# EAGLE design Drive_7seg (EAGLE 7.2.0)
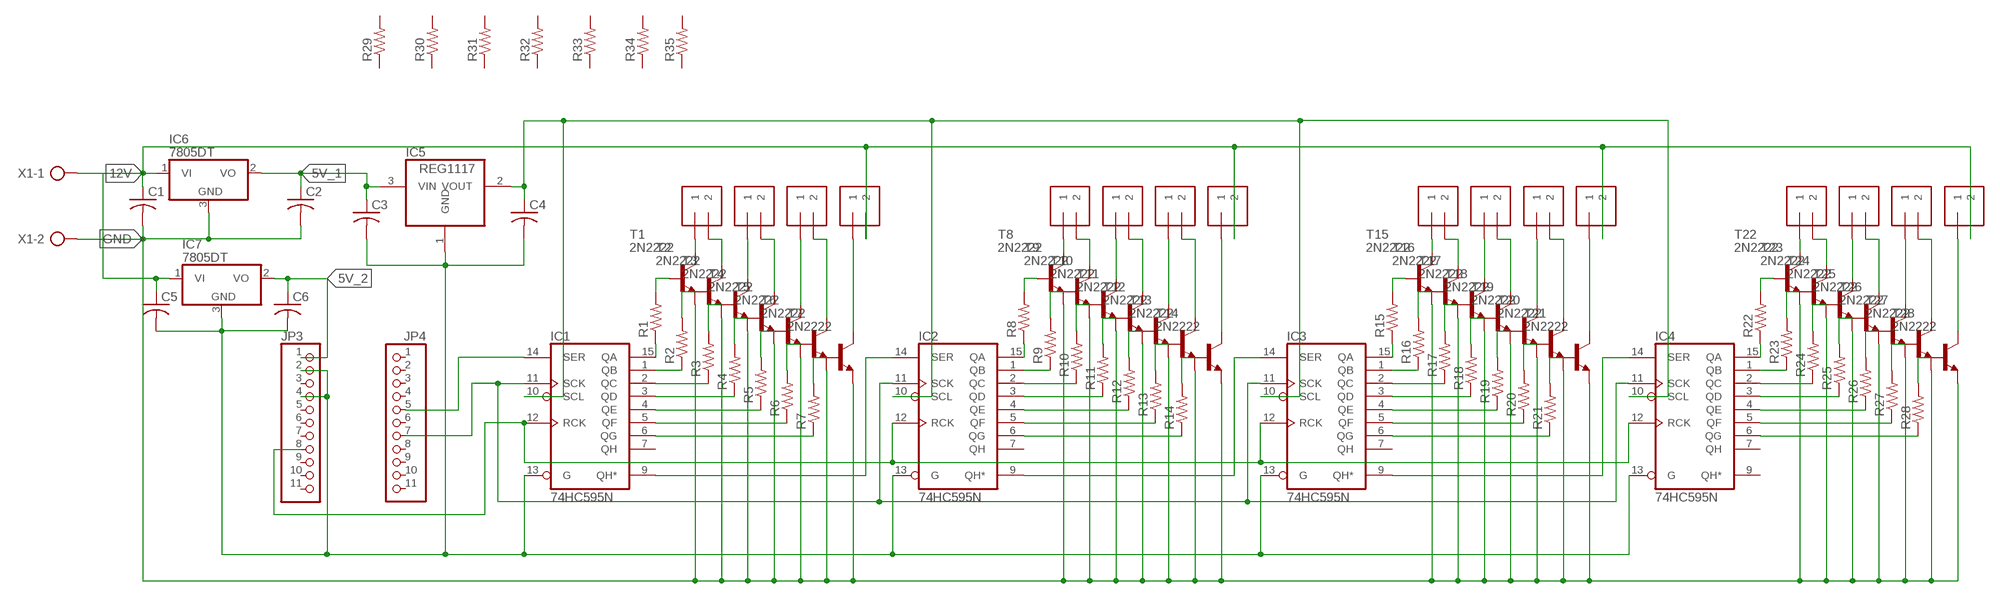
[diagram p0: schematic, sheet 1]

## Parts
C1  C-USC0805K  [C0805K]
C2  C-USC0805K  [C0805K]
C3  C-USC0805K  [C0805K]
C4  C-USC0805K  [C0805K]
C5  C-USC0805K  [C0805K]
C6  C-USC0805K  [C0805K]
IC1  74HC595N  [DIL16]
IC2  74HC595N  [DIL16]
IC3  74HC595N  [DIL16]
IC4  74HC595N  [DIL16]
IC5  REG1117  [SOT223]
IC6  7805DT  [TO252]
IC7  7805DT  [TO252]
J1  1X2-3.5MM  [1X2-3.5MM]
J2  1X2-3.5MM  [1X2-3.5MM]
J3  1X2-3.5MM  [1X2-3.5MM]
J4  1X2-3.5MM  [1X2-3.5MM]
J5  1X2-3.5MM  [1X2-3.5MM]
J6  1X2-3.5MM  [1X2-3.5MM]
J7  1X2-3.5MM  [1X2-3.5MM]
J8  1X2-3.5MM  [1X2-3.5MM]
J9  1X2-3.5MM  [1X2-3.5MM]
J10  1X2-3.5MM  [1X2-3.5MM]
J11  1X2-3.5MM  [1X2-3.5MM]
J12  1X2-3.5MM  [1X2-3.5MM]
J13  1X2-3.5MM  [1X2-3.5MM]
J14  1X2-3.5MM  [1X2-3.5MM]
J15  1X2-3.5MM  [1X2-3.5MM]
J16  1X2-3.5MM  [1X2-3.5MM]
JP3  PINHD-1X11  [1X11]
JP4  PINHD-1X11  [1X11]
R1  R-US_0204/7  [0204/7]
R2  R-US_0204/7  [0204/7]
R3  R-US_0204/7  [0204/7]
R4  R-US_0204/7  [0204/7]
R5  R-US_0204/7  [0204/7]
R6  R-US_0204/7  [0204/7]
R7  R-US_0204/7  [0204/7]
R8  R-US_0204/7  [0204/7]
R9  R-US_0204/7  [0204/7]
R10  R-US_0204/7  [0204/7]
R11  R-US_0204/7  [0204/7]
R12  R-US_0204/7  [0204/7]
R13  R-US_0204/7  [0204/7]
R14  R-US_0204/7  [0204/7]
R15  R-US_0204/7  [0204/7]
R16  R-US_0204/7  [0204/7]
R17  R-US_0204/7  [0204/7]
R18  R-US_0204/7  [0204/7]
R19  R-US_0204/7  [0204/7]
R20  R-US_0204/7  [0204/7]
R21  R-US_0204/7  [0204/7]
R22  R-US_0204/7  [0204/7]
R23  R-US_0204/7  [0204/7]
R24  R-US_0204/7  [0204/7]
R25  R-US_0204/7  [0204/7]
R26  R-US_0204/7  [0204/7]
R27  R-US_0204/7  [0204/7]
R28  R-US_0204/7  [0204/7]
R29  R-US_0204/7  [0204/7]
R30  R-US_0204/7  [0204/7]
R31  R-US_0204/7  [0204/7]
R32  R-US_0204/7  [0204/7]
R33  R-US_0204/7  [0204/7]
R34  R-US_0204/7  [0204/7]
R35  R-US_0204/7  [0204/7]
T1  2N2222  [TO92-EBC-OVAL]
T2  2N2222  [TO92-EBC-OVAL]
T3  2N2222  [TO92-EBC-OVAL]
T4  2N2222  [TO92-EBC-OVAL]
T5  2N2222  [TO92-EBC-OVAL]
T6  2N2222  [TO92-EBC-OVAL]
T7  2N2222  [TO92-EBC-OVAL]
T8  2N2222  [TO92-EBC-OVAL]
T9  2N2222  [TO92-EBC-OVAL]
T10  2N2222  [TO92-EBC-OVAL]
T11  2N2222  [TO92-EBC-OVAL]
T12  2N2222  [TO92-EBC-OVAL]
T13  2N2222  [TO92-EBC-OVAL]
T14  2N2222  [TO92-EBC-OVAL]
T15  2N2222  [TO92-EBC-OVAL]
T16  2N2222  [TO92-EBC-OVAL]
T17  2N2222  [TO92-EBC-OVAL]
T18  2N2222  [TO92-EBC-OVAL]
T19  2N2222  [TO92-EBC-OVAL]
T20  2N2222  [TO92-EBC-OVAL]
T21  2N2222  [TO92-EBC-OVAL]
T22  2N2222  [TO92-EBC-OVAL]
T23  2N2222  [TO92-EBC-OVAL]
T24  2N2222  [TO92-EBC-OVAL]
T25  2N2222  [TO92-EBC-OVAL]
T26  2N2222  [TO92-EBC-OVAL]
T27  2N2222  [TO92-EBC-OVAL]
T28  2N2222  [TO92-EBC-OVAL]
X1  AK300/2  [AK300/2]

## Nets
5V_1: C2.1 C3.1 IC5.3(VIN) IC6.2(VO)
5V_2: C6.1 IC7.2(VO) JP3.1
12V: C1.1 C5.1 IC6.1(VI) IC7.1(VI) J4.2 J8.2 J12.2 J16.2 X1.1
GND: C1.2 C2.2 C3.2 C4.2 C5.2 C6.2 IC1.13(G) IC2.13(G) IC3.13(G) IC4.13(G) IC5.1(GND) IC6.3(GND) IC7.3(GND) JP3.2 JP3.4 T1.E T2.E T3.E T4.E T5.E T6.E T7.E T8.E T9.E T10.E T11.E T12.E T13.E T14.E T15.E T16.E T17.E T18.E T19.E T20.E T21.E T22.E T23.E T24.E T25.E T26.E T27.E T28.E X1.2
N$1: R1.2 T1.B
N$2: R2.2 T2.B
N$3: R3.2 T3.B
N$4: R4.2 T4.B
N$5: R5.2 T5.B
N$6: R6.2 T6.B
N$7: R7.2 T7.B
N$8: IC1.15(QA) R1.1
N$9: IC1.1(QB) R2.1
N$10: IC1.2(QC) R3.1
N$11: IC1.3(QD) R4.1
N$12: IC1.4(QE) R5.1
N$13: IC1.5(QF) R6.1
N$14: IC1.6(QG) R7.1
N$15: IC1.9(QH*) IC2.14(SER)
N$16: IC2.9(QH*) IC3.14(SER)
N$17: IC3.9(QH*) IC4.14(SER)
N$18: IC1.12(RCK) IC2.12(RCK) IC3.12(RCK) IC4.12(RCK) JP3.8
N$19: IC1.11(SCK) IC2.11(SCK) IC3.11(SCK) IC4.11(SCK) JP4.7
N$20: IC1.14(SER) JP4.5
N$22: J1.1 T1.C
N$23: J1.2 T2.C
N$24: J2.1 T3.C
N$25: J2.2 T4.C
N$26: J3.1 T5.C
N$27: J3.2 T6.C
N$28: J4.1 T7.C
N$29: R9.2 T9.B
N$30: R10.2 T10.B
N$31: R8.2 T8.B
N$32: R11.2 T11.B
N$33: R12.2 T12.B
N$34: R13.2 T13.B
N$35: R14.2 T14.B
N$36: IC2.15(QA) R8.1
N$37: IC2.1(QB) R9.1
N$38: IC2.2(QC) R10.1
N$39: IC2.3(QD) R11.1
N$40: IC2.4(QE) R12.1
N$41: IC2.5(QF) R13.1
N$42: IC2.6(QG) R14.1
N$50: J5.1 T8.C
N$51: J5.2 T9.C
N$52: J6.1 T10.C
N$53: J6.2 T11.C
N$54: J7.1 T12.C
N$55: J7.2 T13.C
N$56: J8.1 T14.C
N$57: R16.2 T16.B
N$58: R17.2 T17.B
N$59: R15.2 T15.B
N$60: R18.2 T18.B
N$61: R19.2 T19.B
N$62: R20.2 T20.B
N$63: R21.2 T21.B
N$64: IC3.15(QA) R15.1
N$65: IC3.1(QB) R16.1
N$66: IC3.2(QC) R17.1
N$67: IC3.3(QD) R18.1
N$68: IC3.4(QE) R19.1
N$69: IC3.5(QF) R20.1
N$70: IC3.6(QG) R21.1
N$78: J9.1 T15.C
N$79: J9.2 T16.C
N$80: J10.1 T17.C
N$81: J10.2 T18.C
N$82: J11.1 T19.C
N$83: J11.2 T20.C
N$84: J12.1 T21.C
N$85: R23.2 T23.B
N$86: R24.2 T24.B
N$87: R22.2 T22.B
N$88: R25.2 T25.B
N$89: R26.2 T26.B
N$90: R27.2 T27.B
N$91: R28.2 T28.B
N$92: IC4.15(QA) R22.1
N$93: IC4.1(QB) R23.1
N$94: IC4.2(QC) R24.1
N$95: IC4.3(QD) R25.1
N$96: IC4.4(QE) R26.1
N$97: IC4.5(QF) R27.1
N$98: IC4.6(QG) R28.1
N$106: J13.1 T22.C
N$107: J13.2 T23.C
N$108: J14.1 T24.C
N$109: J14.2 T25.C
N$110: J15.1 T26.C
N$111: J15.2 T27.C
N$112: J16.1 T28.C
VCC: C4.1 IC1.10(SCL) IC2.10(SCL) IC3.10(SCL) IC4.10(SCL) IC5.2(VOUT)
Unconnected: IC1.7(QH) IC2.7(QH) IC3.7(QH) IC4.7(QH) IC4.9(QH*) JP3.3 JP3.5 JP3.6 JP3.7 JP3.9 JP3.10 JP3.11 JP4.1 JP4.2 JP4.3 JP4.4 JP4.6 JP4.8 JP4.9 JP4.10 JP4.11 R29.1 R29.2 R30.1 R30.2 R31.1 R31.2 R32.1 R32.2 R33.1 R33.2 R34.1 R34.2 R35.1 R35.2

## Power pins joined to a net without a drawn wire
GND: IC1.8(GND) IC2.8(GND) IC3.8(GND) IC4.8(GND)
VCC: IC1.16(VCC) IC2.16(VCC) IC3.16(VCC) IC4.16(VCC)

## Library data of the parts
C1-C6 = adafruit:C-US: CAPACITOR, American symbol
IC1-IC4 = 74xx-eu:74*595: 8-bit SHIFT REGISTER, output latch
IC5 = burr-brown:REG1117: 800mA and 1A Low Dropout (LDO) Positive Regulator 1.8V, 2.5V, 2.85V, 3.3V, 5V, and Adj; MPN: REG1117; OC_FARNELL: 1097566; OC_NEWARK: 14P6981
IC6 IC7 = adafruit:78*: Positive VOLTAGE REGULATOR Added bigger pads to the TO-92 package
J1-J16 = adafruit:1X2: 3.5mm Terminal block http://www.ladyada.net/library/pcb/eaglelibrary.html
JP3 JP4 = pinhead:PINHD-1X11: PIN HEADER
R1-R35 = adafruit:R-US_: RESISTOR, American symbol
T1-T28 = adafruit:2N2222: NPN TRANSISTOR Big oval pads
X1 = con-ptr500:AK300/2: CONNECTOR; OC_FARNELL: unknown; OC_NEWARK: unknown

## Board
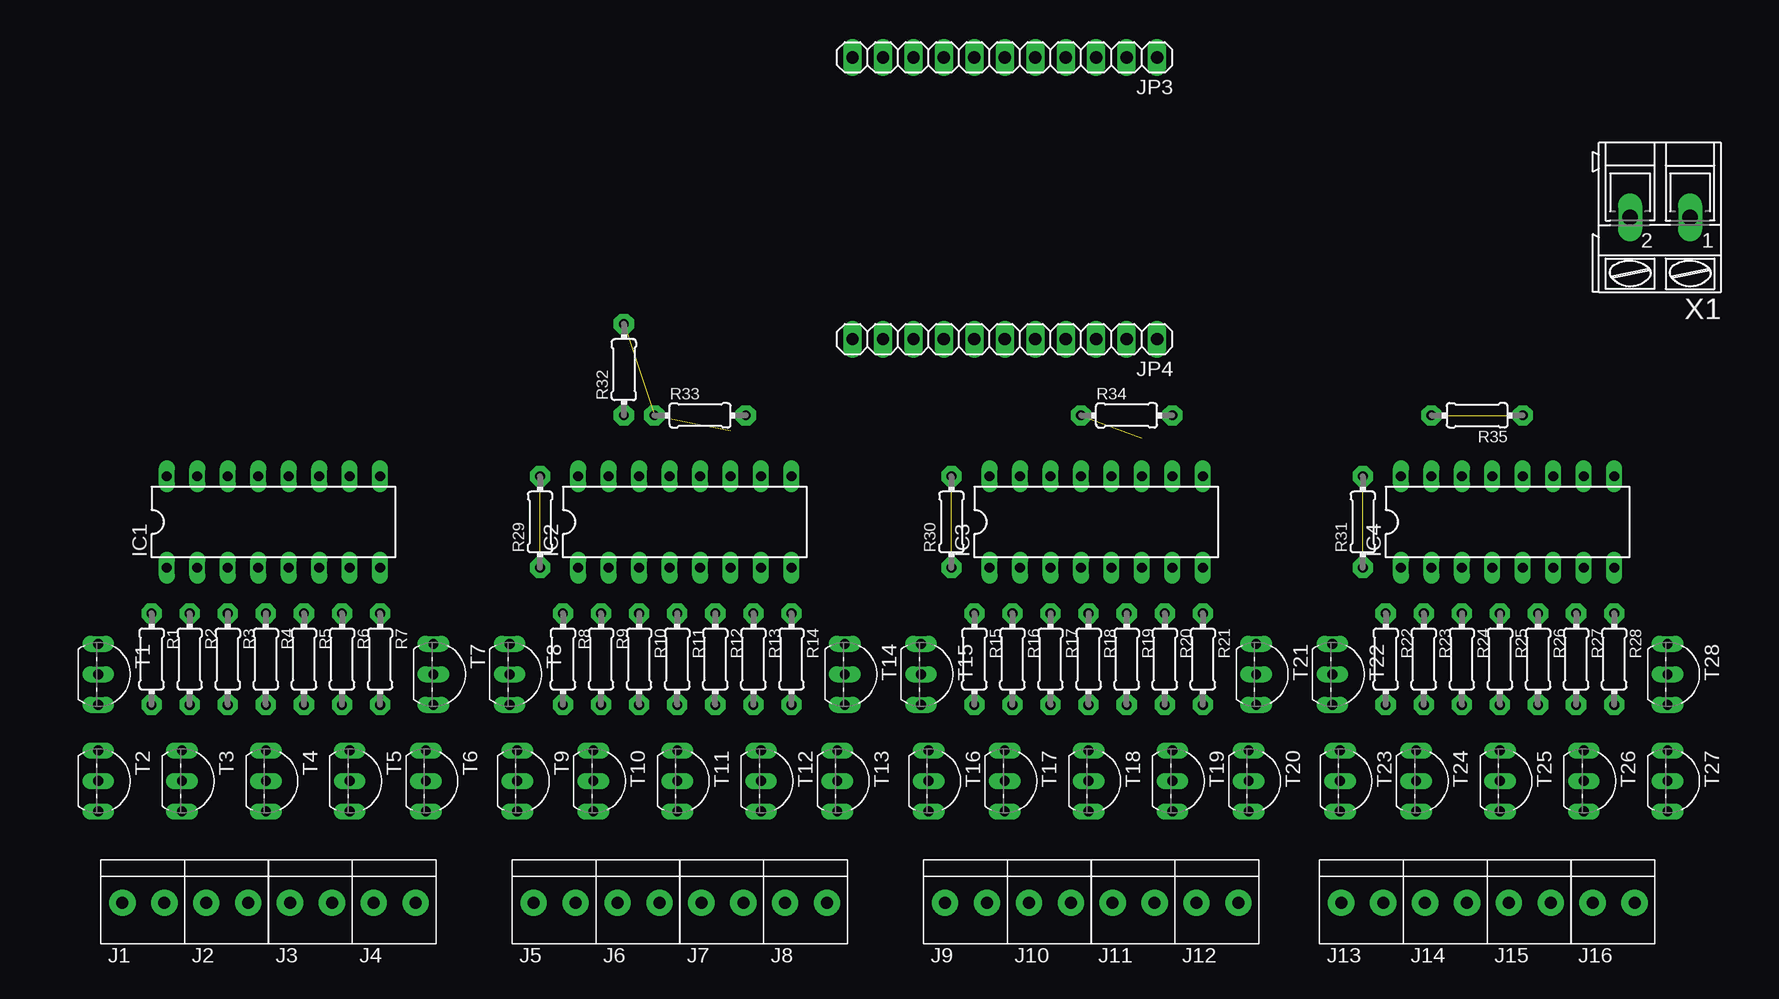
[diagram p1: board, top side]
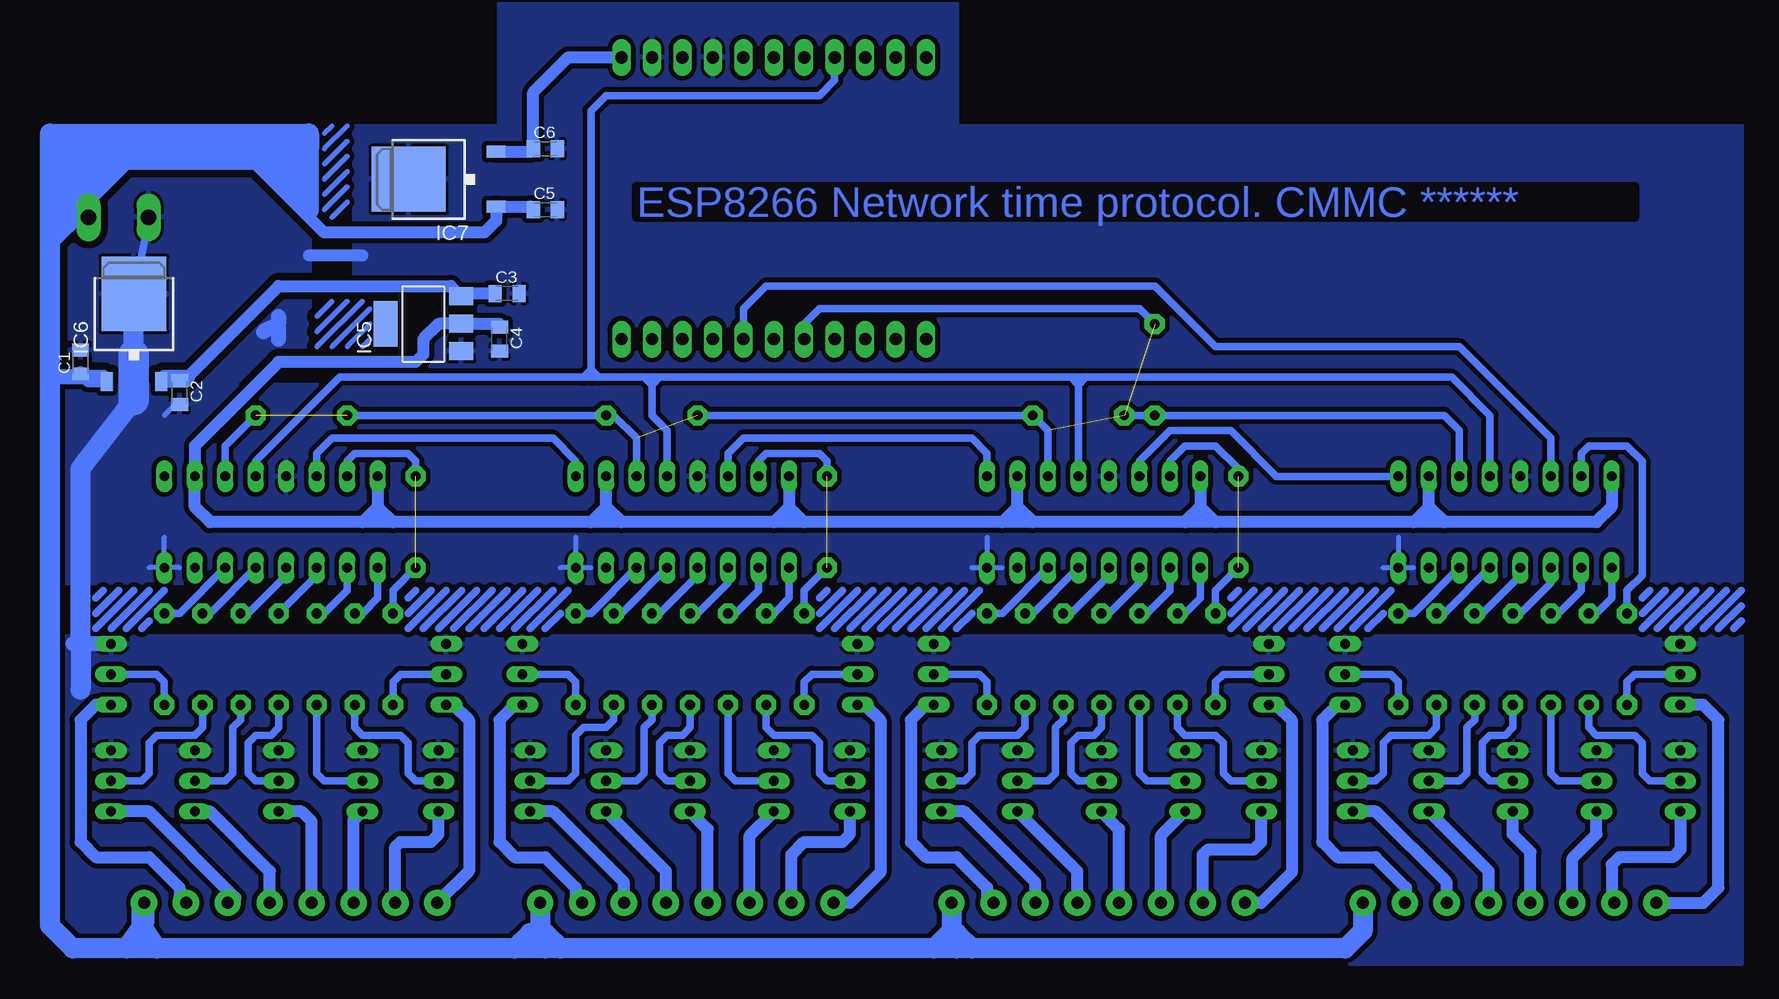
[diagram p2: board, bottom side, seen from below]

No outline drawn. Coordinates in mm, seen from the top.
Copper layers (1*16): Top 0.035mm / dielectric 1.5mm / Bottom 0.035mm
Design rules "default": minimum track width 10mil, minimum drill 24mil, track to track 8mil, track to pad 8mil, pad to pad 8mil, via to via 8mil, smd to smd 8mil, copper to edge 40mil, drill to drill 8mil, minimum pad ring 10mil, minimum via ring 8mil, stop-mask expansion 4mil, vias tented up to drill 0mil, thermal gap 10mil

### Footprints (pad centres in the part's own frame; a part is rotated, then mirrored left to right if it is on the bottom)
C0805K = smd 1.1 x 1.4: 1 -1,0; 2 1,0
DIL16 = drill 0.813 long: 1 -8.89,-3.81; 2 -6.35,-3.81; 3 -3.81,-3.81; 4 -1.27,-3.81; 5 1.27,-3.81; 6 3.81,-3.81; 7 6.35,-3.81; 8 8.89,-3.81; 9 8.89,3.81; 10 6.35,3.81; 11 3.81,3.81; 12 1.27,3.81; 13 -1.27,3.81; 14 -3.81,3.81; 15 -6.35,3.81; 16 -8.89,3.81
SOT223 = smd 1.499 x 2.007: 1 -2.261,-3.15; 2 0.025,-3.15; 3 2.311,-3.15 | smd 3.81 x 2.007: 4 0,3.15
TO252 = smd 1 x 1.6: 1 -2.28,-4.8; 2 2.28,-4.8 | smd 5.4 x 6.2: 3 0,2.5
1X2-3.5MM = drill 1 pad 2.184: 1 1.8,0; 2 -1.7,0
1X11 = drill 1.016 long: 1 -12.7,0; 2 -10.16,0; 3 -7.62,0; 4 -5.08,0; 5 -2.54,0; 6 0,0; 7 2.54,0; 8 5.08,0; 9 7.62,0; 10 10.16,0; 11 12.7,0
0204/7 = drill 0.813 pad 1.676 octagon: 1 -3.81,0; 2 3.81,0
TO92-EBC-OVAL = drill 0.813 long: B 0,-1.27; C 2.54,-1.27; E -2.54,-1.27
AK300/2 = drill 1.321 long: 1 -2.515,0; 2 2.489,0

### Placement (x,y rotation side)
C1  156.84,57.78 90 bottom
C2  148.59,55.24 270 bottom
C3  121.28,63.5 0 bottom
C4  121.92,59.69 270 bottom
C5  118.11,70.48 0 bottom
C6  118.11,75.56 0 bottom
IC1  38.1,44.45 0 top
IC2  72.39,44.45 0 top
IC3  106.68,44.45 0 top
IC4  140.97,44.45 0 top
IC5  128.27,60.96 90 bottom
IC6  152.4,60.96 0 bottom
IC7  127,73.03 90 bottom
J1  27.3,12.7 180 top
J2  34.29,12.7 180 top
J3  41.27,12.7 180 top
J4  48.26,12.7 180 top
J5  61.59,12.7 180 top
J6  68.58,12.7 180 top
J7  75.56,12.7 180 top
J8  82.55,12.7 180 top
J9  95.89,12.7 180 top
J10  102.87,12.7 180 top
J11  109.86,12.7 180 top
J12  116.84,12.7 180 top
J13  128.91,12.7 180 top
J14  135.89,12.7 180 top
J15  142.88,12.7 180 top
J16  149.86,12.7 180 top
JP3  99.06,83.19 180 top
JP4  99.06,59.69 180 top
R1  27.94,33.02 270 top
R2  31.11,33.02 270 top
R3  34.29,33.02 270 top
R4  37.47,33.02 270 top
R5  40.64,33.02 270 top
R6  43.81,33.02 270 top
R7  46.99,33.02 270 top
R8  62.23,33.02 270 top
R9  65.41,33.02 270 top
R10  68.58,33.02 270 top
R11  71.75,33.02 270 top
R12  74.93,33.02 270 top
R13  78.11,33.02 270 top
R14  81.28,33.02 270 top
R15  96.52,33.02 270 top
R16  99.69,33.02 270 top
R17  102.87,33.02 270 top
R18  106.05,33.02 270 top
R19  109.22,33.02 270 top
R20  112.39,33.02 270 top
R21  115.57,33.02 270 top
R22  130.81,33.02 270 top
R23  133.99,33.02 270 top
R24  137.16,33.02 270 top
R25  140.34,33.02 270 top
R26  143.51,33.02 270 top
R27  146.69,33.02 270 top
R28  149.86,33.02 270 top
R29  60.33,44.45 90 top
R30  94.61,44.45 90 top
R31  128.91,44.45 90 top
R32  67.31,57.15 90 top
R33  73.66,53.34 0 top
R34  109.22,53.34 0 top
R35  138.43,53.34 180 top
T1  24.77,31.75 270 top
T2  24.77,22.86 270 top
T3  31.75,22.86 270 top
T4  38.73,22.86 270 top
T5  45.72,22.86 270 top
T6  52.07,22.86 270 top
T7  52.7,31.75 270 top
T8  59.05,31.75 270 top
T9  59.69,22.86 270 top
T10  66.04,22.86 270 top
T11  73.03,22.86 270 top
T12  80.01,22.86 270 top
T13  86.36,22.86 270 top
T14  87,31.75 270 top
T15  93.34,31.75 270 top
T16  93.98,22.86 270 top
T17  100.33,22.86 270 top
T18  107.31,22.86 270 top
T19  114.3,22.86 270 top
T20  120.65,22.86 270 top
T21  121.28,31.75 270 top
T22  127.64,31.75 270 top
T23  128.27,22.86 270 top
T24  134.62,22.86 270 top
T25  141.6,22.86 270 top
T26  148.59,22.86 270 top
T27  155.57,22.86 270 top
T28  155.57,31.75 270 top
X1  153.67,69.85 180 top

### Tracks (layer width: path | path; a pad name or v marks a point on that pad's centre or on a via)
5V_1
  Bottom 1.016: IC6.2 147.97,56.16 | 147.97,56.16 C2.1 | C3.1 124.89,63.5 IC5.3 125.98,64.14 140.34,64.14 147.97,56.51 147.97,56.16
5V_2
  Bottom 1.016: IC7.2 119.37,75.31 C6.1 119.11,80.28 116.2,83.19 JP3.1
12V
  Bottom 1.016: IC6.1 156.2,56.16 C1.1 | 158.12,69.22 153.03,74.3 142.24,74.3 136.53,68.58 123.19,68.58 122.2,69.57 IC7.1 119.37,70.75 C5.1
  Bottom 1.27: 151.76,12.49 J16.2 | 118.54,9.32 118.11,8.89 | 84.25,9.32 83.82,8.89 | C1.1 156.21,56.52 | 156.21,56.52 159.38,56.52 | 156.21,56.52 154.94,56.52
  Bottom 1.676: J4.2 49.96,10.37 51.44,8.89 82.55,8.89 | 82.55,8.89 83.82,8.89 85.72,8.89 | 85.72,8.89 116.84,8.89 | 116.84,8.89 118.11,8.89 120.65,8.89 | 120.65,8.89 150.5,8.89 | 150.5,8.89 151.76,10.79 151.76,12.49 | J12.2 118.54,9.32 | J8.2 84.25,9.32 | J16.2 151.56,11 153.03,8.89 | 153.03,8.89 157.48,8.89 159.38,10.79 159.38,56.52 159.38,67.94 | 159.38,67.94 158.12,69.22 157.48,69.85 X1.1 | 159.38,67.94 159.38,76.83 137.79,76.83 137.79,75.56 | 139.06,74.3 137.79,70.48 137.79,75.56 | 139.06,74.3 137.79,75.56 | 137.79,75.56 158.12,75.56 158.12,71.12 158.75,70.48 157.48,70.48 153.03,74.93 | 153.03,74.93 154.94,74.93 | 154.94,74.93 156.21,74.93 156.84,74.3 156.84,72.39 157.48,71.75 157.48,72.39 154.94,74.93 | 153.03,74.93 141.6,74.93 138.43,71.75 138.43,73.66 139.06,74.3 | 139.06,74.3 139.7,74.93 | 150.5,8.89 153.03,8.89 | 82.55,8.89 83.82,10.16 | 85.72,8.89 84.45,10.16 | 119.38,10.16 120.65,8.89 | 118.11,10.16 116.84,8.89
GND
  Bottom 0.406: IC4.8 151.13,40.64 | 148.59,40.64 IC4.8 | IC4.8 149.86,43.18 | 115.57,43.18 IC3.8 | IC3.8 116.84,40.64 | IC3.8 114.3,40.64 | 82.55,40.64 IC2.8 | 81.28,43.18 IC2.8 | IC2.8 80.01,40.64 | 48.26,40.64 IC1.8 | 46.99,43.18 IC1.8 | IC1.8 45.72,40.64 | C2.2 148.96,54.24 149.86,53.34
  Bottom 0.61: IC6.3 151.13,69.8 X1.2
  Bottom 1.016: 133.35,66.67 137.79,66.67
  Bottom 1.27: T28.E 156.84,34.29 157.48,34.29 | 140.34,61.59 140.34,60.96 | 140.34,59.69 140.34,60.96 | 140.34,60.96 141.6,60.33
  Bottom 1.676: 156.84,30.48 156.84,34.29 156.84,48.9 152.4,54.61 | 152.4,58.42 IC6.3
  Bottom 2.54: 152.4,58.42 152.4,54.61
  pour Bottom (isolate 0.4): 18.41,39.37 160.02,39.37 160.02,55.88 133.99,55.88 133.99,77.47 121.92,77.47 121.92,87.63 83.82,87.63 83.82,77.47 18.41,77.47
  pour Bottom (isolate 0.4): 18.41,7.62 160.02,7.62 160.02,34.92 18.41,34.92
  pour Bottom (isolate 0.6): 137.79,86.36 137.79,55.88 160.02,54.61 160.02,86.36
N$1
  Bottom 0.61: T1.B 27.3,31.75 27.94,31.11 R1.2
N$2
  Bottom 0.61: R2.2 31.11,27.3 30.48,26.67 27.3,26.67 26.67,26.04 26.67,23.5 26.04,22.86 T2.B
N$3
  Bottom 0.61: T3.B 33.66,22.86 34.29,23.5 R3.2
N$4
  Bottom 0.61: R4.2 37.47,27.3 38.1,26.67 39.37,26.67 40.01,26.04 40.01,23.5 39.37,22.86 T4.B
N$5
  Bottom 0.61: R5.2 40.64,27.94 41.27,27.3 41.27,23.5 41.91,22.86 43.18,22.86 T5.B
N$6
  Bottom 0.61: R6.2 43.81,27.3 44.45,26.67 47.62,26.67 48.26,26.04 48.26,23.5 48.9,22.86 T6.B
N$7
  Bottom 0.61: R7.2 46.99,31.11 47.62,31.75 T7.B
N$8
  Bottom 0.61: R1.1 27.94,38.73 26.67,40.01 26.67,49.53 27.94,50.8 31.11,50.8 31.75,50.16 IC1.15
N$9
  Bottom 0.61: R2.1 30.89,36.83 arc-45 30.19,37.12 29.21,38.1 IC1.1
N$10
  Bottom 0.61: R3.1 33.66,36.83 31.75,38.73 IC1.2
N$11
  Bottom 0.61: R4.1 36.83,36.83 34.29,39.37 IC1.3
N$12
  Bottom 0.61: R5.1 40.01,36.83 36.83,40.01 IC1.4
N$13
  Bottom 0.61: R6.1 43.18,36.83 IC1.5
N$14
  Bottom 0.61: R7.1 45.72,36.83 IC1.6
N$15
  Bottom 0.61: IC1.9 57.15,48.26 60.96,52.07 66.04,52.07 68.58,49.53 IC2.14
N$16
  Bottom 0.61: IC2.9 81.28,50.16 82.55,51.44 101.6,51.44 102.87,50.16 IC3.14
N$17
  Bottom 0.61: IC3.9 115.57,49.53 117.47,51.44 135.89,51.44 137.16,50.16 IC4.14
N$18
  Bottom 0.61: IC4.12 142.24,49.53 135.25,56.52 114.94,56.52 | IC3.12 107.95,52.07 109.22,53.34 109.22,55.88 | IC2.12 73.66,55.88 | 73.66,55.88 73.66,56.52 | 109.22,56.52 109.86,56.52 | 109.86,56.52 113.67,56.52 | 113.67,56.52 114.3,56.52 | 114.3,56.52 114.94,56.52 | 109.22,55.88 109.22,56.52 | IC1.12 39.37,53.34 42.55,56.52 73.03,56.52 | 73.03,56.52 73.66,56.52 | 73.66,56.52 74.3,56.52 | 74.3,56.52 108.58,56.52 | 108.58,56.52 109.22,56.52 | 73.03,56.52 73.66,55.88 | 73.66,55.88 74.3,56.52 | 108.58,56.52 109.22,55.88 | 109.22,55.88 109.86,56.52 | JP3.8 93.98,81.28 95.25,80.01 113.03,80.01 114.3,78.74 114.3,57.15 | 114.3,57.15 114.3,56.52 | 114.3,57.15 113.67,56.52 | 114.3,57.15 114.94,56.52
N$19  (4 unrouted)
  Bottom 0.61: IC4.11 144.78,50.8 142.24,53.34 | IC3.11 110.49,51.44 112.39,53.34 134.62,53.34 | IC2.11 76.2,52.07 77.47,53.34 105.41,53.34 | IC1.11 41.91,52.07 43.18,53.34 69.85,53.34 | JP4.7 96.52,60.96 95.25,62.23 68.58,62.23 67.31,60.96
N$20
  Bottom 0.61: IC1.14 34.29,51.44 41.91,59.05 62.23,59.05 67.31,64.14 99.69,64.14 101.6,62.23 JP4.5
N$21
  Bottom 0.61: 18.41,36.2 19.05,35.56
N$22
  Bottom 1.016: J1.1 21.59,12.7 20.32,13.97 20.32,27.94 21.59,29.21 T1.C
N$23
  Bottom 1.016: T2.C 23.5,17.14 24.13,16.51 28.57,16.51 29.21,15.88 29.21,12.9 J1.2
N$24
  Bottom 1.016: J2.1 32.49,16.41 30.48,18.41 T3.C
N$25
  Bottom 1.016: J2.2 35.99,16.94 37.47,18.41 T4.C
N$26
  Bottom 1.016: J3.1 39.48,15.35 T5.C
N$27
  Bottom 1.016: J3.2 42.98,14.4 48.9,20.32 T6.C
N$28
  Bottom 1.016: T7.C 52.07,29.21 53.34,27.94 53.34,17.78 52.07,16.51 48.9,16.51 46.35,13.97 46.35,12.8 J4.1
N$29
  Bottom 0.61: R9.2 65.41,27.3 64.77,26.67 62.23,26.67 61.59,26.04 61.59,23.5 60.96,22.86 T9.B
N$30
  Bottom 0.61: T10.B 67.94,22.86 68.58,23.5 R10.2
N$31
  Bottom 0.61: R8.2 62.23,31.11 61.59,31.75 T8.B
N$32
  Bottom 0.61: T11.B 73.66,22.86 74.3,23.5 74.3,26.04 73.66,26.67 72.39,26.67 71.75,27.3 R11.2
N$33
  Bottom 0.61: T12.B 76.2,22.86 75.56,23.5 75.56,27.3 74.93,27.94 R12.2
N$34
  Bottom 0.61: R13.2 78.11,27.3 78.74,26.67 81.92,26.67 82.55,26.04 82.55,23.5 83.19,22.86 T13.B
N$35
  Bottom 0.61: R14.2 81.28,31.11 81.92,31.75 T14.B
N$36  (1 unrouted)
  Bottom 0.61: R8.1 62.23,38.73 60.33,40.64 | IC2.15 66.04,49.53 64.77,50.8 62.23,50.8 60.33,48.9 60.33,48.26
N$37
  Bottom 0.61: R9.1 64.77,36.83 63.5,38.1 IC2.1
N$38
  Bottom 0.61: R10.1 67.94,36.83 66.04,38.73 IC2.2
N$39
  Bottom 0.61: R11.1 71.12,36.83 68.58,39.37 IC2.3
N$40
  Bottom 0.61: R12.1 74.3,36.83 71.12,40.01 IC2.4
N$41
  Bottom 0.61: R13.1 77.47,36.83 IC2.5
N$42
  Bottom 0.61: R14.1 80.01,36.83 IC2.6
N$43
  Bottom 0.61: 18.41,37.47 20.32,35.56
N$44
  Bottom 0.61: 18.41,38.73 21.59,35.56
N$45
  Bottom 0.61: 19.68,38.73 22.86,35.56
N$46
  Bottom 0.61: 20.95,38.73 24.13,35.56
N$47
  Bottom 0.61: 22.23,38.73 25.4,35.56
N$48
  Bottom 0.61: 23.5,38.73 26.67,35.56
N$49
  Bottom 0.61: 24.77,38.73 26.67,36.83
N$50
  Bottom 1.016: T8.C 57.15,29.21 55.88,27.94 55.88,15.24 58.42,12.7 J5.1
N$51
  Bottom 1.016: J5.2 63.3,16.71 62.87,17.14 59.05,17.14 58.42,17.78 T9.C
N$52
  Bottom 1.016: J6.1 66.78,18.31 T10.C
N$53
  Bottom 1.016: J6.2 70.28,18.84 T11.C
N$54
  Bottom 1.016: J7.1 73.77,15.35 T12.C
N$55
  Bottom 1.016: J7.2 77.27,14.4 83.19,20.32 T13.C
N$56
  Bottom 1.016: T14.C 86.36,29.21 87.63,27.94 87.63,17.78 86.36,16.51 83.82,16.51 81.28,13.97 81.28,13.23 J8.1
N$57
  Bottom 0.61: T16.B 94.61,22.86 95.25,23.5 95.25,26.04 95.89,26.67 99.06,26.67 99.69,27.3 R16.2
N$58
  Bottom 0.61: T17.B 102.23,22.86 102.87,23.5 R17.2
N$59
  Bottom 0.61: R15.2 96.52,31.11 95.89,31.75 T15.B
N$60
  Bottom 0.61: T18.B 107.95,22.86 108.58,23.5 108.58,26.04 107.95,26.67 106.68,26.67 106.05,27.3 R18.2
N$61
  Bottom 0.61: T19.B 110.49,22.86 109.86,23.5 109.86,27.3 109.22,27.94 R19.2
N$62
  Bottom 0.61: R20.2 112.39,27.94 113.03,27.3 114.94,27.3 115.57,26.67 115.57,23.5 116.2,22.86 T20.B
N$63
  Bottom 0.61: R21.2 115.57,31.11 116.2,31.75 T21.B
N$64  (1 unrouted)
  Bottom 0.61: R15.1 96.52,38.73 94.61,40.64 | IC3.15 100.33,49.53 99.69,50.16 95.25,50.16 94.61,49.53 94.61,48.26
N$65
  Bottom 0.61: R16.1 99.06,36.83 97.79,38.1 IC3.1
N$66
  Bottom 0.61: R17.1 102.23,36.83 100.33,38.73 IC3.2
N$67
  Bottom 0.61: R18.1 105.41,36.83 102.87,39.37 IC3.3
N$68
  Bottom 0.61: R19.1 108.58,36.83 105.41,40.01 IC3.4
N$69
  Bottom 0.61: R20.1 111.76,36.83 IC3.5
N$70
  Bottom 0.61: R21.1 114.3,36.83 IC3.6
N$71
  Bottom 0.61: 82.55,36.83 83.82,35.56
N$72
  Bottom 0.61: 26.04,38.73 26.67,38.1
N$73
  Bottom 0.61: 47.62,38.73 50.8,35.56
N$74
  Bottom 0.61: 48.9,38.73 52.07,35.56
N$75
  Bottom 0.61: 50.16,38.73 53.34,35.56
N$76
  Bottom 0.61: 51.44,38.73 54.61,35.56
N$77
  Bottom 0.61: 52.7,38.73 55.88,35.56
N$78
  Bottom 1.016: T15.C 91.44,29.21 90.17,27.94 90.17,15.24 92.71,12.7 J9.1
N$79
  Bottom 1.016: J9.2 97.58,16.71 96.52,17.78 93.34,17.78 92.71,18.41 T16.C
N$80
  Bottom 1.016: J10.1 101.07,18.31 T17.C
N$81
  Bottom 1.016: J10.2 104.57,18.84 T18.C
N$82
  Bottom 1.016: J11.1 108.06,15.35 T19.C
N$83
  Bottom 1.016: J11.2 111.56,14.4 117.47,20.32 T20.C
N$84
  Bottom 1.016: T21.C 120.65,29.21 121.92,27.94 121.92,17.78 120.65,16.51 118.11,16.51 115.57,13.97 115.57,13.23 J12.1
N$85
  Bottom 0.61: T23.B 128.91,22.86 129.54,23.5 129.54,26.04 130.18,26.67 133.35,26.67 133.99,27.3 R23.2
N$86
  Bottom 0.61: T24.B 136.53,22.86 137.16,23.5 R24.2
N$87
  Bottom 0.61: R22.2 130.81,31.11 130.18,31.75 T22.B
N$88
  Bottom 0.61: T25.B 142.24,22.86 142.88,23.5 142.88,26.04 142.24,26.67 140.97,26.67 140.34,27.3 R25.2
N$89
  Bottom 0.61: T26.B 144.78,22.86 144.15,23.5 144.15,27.3 143.51,27.94 R26.2
N$90
  Bottom 0.61: R27.2 146.69,27.3 147.32,26.67 150.5,26.67 151.13,26.04 151.13,23.5 151.76,22.86 T27.B
N$91
  Bottom 0.61: R28.2 149.86,31.11 150.5,31.75 T28.B
N$92  (1 unrouted)
  Bottom 0.61: R22.1 130.81,38.73 128.91,40.64 | IC4.15 134.62,49.53 133.99,50.16 129.54,50.16 128.91,49.53 128.91,48.26
N$93
  Bottom 0.61: R23.1 133.35,36.83 132.08,38.1 IC4.1
N$94
  Bottom 0.61: R24.1 136.53,36.83 134.62,38.73 IC4.2
N$95
  Bottom 0.61: R25.1 137.16,40.01 IC4.3
N$96
  Bottom 0.61: R26.1 142.88,36.83 139.7,40.01 IC4.4
N$97
  Bottom 0.61: R27.1 146.05,36.83 IC4.5
N$98
  Bottom 0.61: R28.1 148.59,36.83 IC4.6
N$99
  Bottom 0.61: 53.98,38.73 57.15,35.56
N$100
  Bottom 0.61: 55.24,38.73 58.42,35.56
N$101
  Bottom 0.61: 56.52,38.73 59.69,35.56
N$102
  Bottom 0.61: 57.78,38.73 60.96,35.56
N$103
  Bottom 0.61: 59.05,38.73 60.96,36.83
N$104
  Bottom 0.61: 60.96,38.1 60.33,38.73
N$105
  Bottom 0.61: 81.92,38.73 85.09,35.56
N$106
  Bottom 1.016: T22.C 125.73,29.21 124.46,27.94 124.46,15.35 J13.1
N$107
  Bottom 1.016: J13.2 130.6,17.35 130.18,17.78 127.64,17.78 127,18.41 T23.C
N$108
  Bottom 1.016: J14.1 134.09,19.58 T24.C
N$109
  Bottom 1.016: J14.2 137.59,19.48 138.43,20.32 T25.C
N$110
  Bottom 1.016: J15.1 141.07,15.35 146.05,20.32 T26.C
N$111
  Bottom 1.016: J15.2 143.94,13.13 151.13,20.32 T27.C
N$112
  Bottom 1.016: T28.C 155.57,29.21 156.84,27.94 156.84,17.78 155.57,16.51 151.13,16.51 148.59,13.97 148.59,13.23 J16.1
N$113
  Bottom 0.61: 48.26,36.83 49.53,35.56
N$114
  Bottom 0.61: 83.19,38.73 86.36,35.56
N$115
  Bottom 0.61: 84.45,38.73 87.63,35.56
N$116
  Bottom 0.61: 85.72,38.73 88.9,35.56
N$117
  Bottom 0.61: 87,38.73 90.17,35.56
N$118
  Bottom 0.61: 88.27,38.73 91.44,35.56
N$119
  Bottom 0.61: 89.53,38.73 92.71,35.56
N$120
  Bottom 0.61: 90.81,38.73 93.98,35.56
N$121
  Bottom 0.61: 92.08,38.73 95.25,35.56
N$122
  Bottom 0.61: 93.34,38.73 95.25,36.83
N$123
  Bottom 0.61: 94.61,38.73 95.25,38.1
N$124
  Bottom 0.61: 116.84,36.83 118.11,35.56
N$125
  Bottom 0.61: 116.2,38.73 119.38,35.56
N$126
  Bottom 0.61: 117.47,38.73 120.65,35.56
N$127
  Bottom 0.61: 118.75,38.73 121.92,35.56
N$128
  Bottom 0.61: 120.02,38.73 123.19,35.56
N$129
  Bottom 0.61: 121.28,38.73 124.46,35.56
N$130
  Bottom 0.61: 122.56,38.73 125.73,35.56
N$131
  Bottom 0.61: 123.83,38.73 127,35.56
N$132
  Bottom 0.61: 125.09,38.73 128.27,35.56
N$133
  Bottom 0.61: 126.36,38.73 129.54,35.56
N$134
  Bottom 0.61: 127.64,38.73 129.54,36.83
N$135
  Bottom 0.61: 128.91,38.73 129.54,38.1
N$136
  Bottom 0.61: 151.13,36.2 151.76,35.56
N$137
  Bottom 0.61: 149.86,38.73 153.03,35.56
N$138
  Bottom 0.61: 151.13,38.73 154.31,35.56
N$139
  Bottom 0.61: 152.4,38.73 155.57,35.56
N$140
  Bottom 0.61: 153.67,38.73 155.57,36.83
N$141
  Bottom 0.61: 154.94,38.73 155.57,38.1
N$142
  Bottom 1.27: 149.86,56.52 147.96,56.52
N$144
  Bottom 0.406: 134.62,77.47 136.53,75.56
N$145
  Bottom 0.406: 135.89,77.47 136.53,76.83
N$146
  Bottom 0.406: 134.62,76.2 136.53,74.3
N$147
  Bottom 0.406: 134.62,74.93 136.53,73.03
N$148
  Bottom 0.406: 134.62,73.66 136.53,71.75
N$149
  Bottom 0.406: 134.62,72.39 136.53,70.48
N$150
  Bottom 0.406: 134.62,71.12 135.89,69.85
N$151
  Bottom 0.406: 133.35,62.87 137.16,59.05
N$152
  Bottom 0.406: 134.62,62.87 137.16,60.33
N$153
  Bottom 0.406: 135.89,62.87 137.16,61.59
N$154
  Bottom 0.406: 132.72,62.23 135.89,59.05
N$155
  Bottom 0.406: 132.72,60.96 134.62,59.05
N$156
  Bottom 0.406: 132.72,59.69 133.35,59.05
VCC
  Bottom 1.016: IC1.16 29.21,45.72 30.48,44.45 43.18,44.45 | 43.18,44.45 44.45,45.72 | 44.45,45.72 IC1.10 | IC2.16 63.5,45.72 | 63.5,45.72 64.77,44.45 | 64.77,44.45 77.47,44.45 | 77.47,44.45 78.74,45.72 | IC3.16 97.79,45.72 | 97.79,45.72 99.06,44.45 | 99.06,44.45 111.76,44.45 | 111.76,44.45 113.03,45.72 | 113.03,45.72 IC3.10 | IC4.16 132.08,45.72 | 132.08,45.72 133.35,44.45 | 133.35,44.45 146.05,44.45 147.32,45.72 IC4.10 147.32,50.8 140.34,57.78 128.91,57.78 128.27,58.42 128.27,59.69 126.97,60.98 IC5.2 125.09,60.96 121.92,60.96 C4.1 | 43.18,44.45 45.72,44.45 | 45.72,44.45 62.23,44.45 | 62.23,44.45 64.77,44.45 | 77.47,44.45 80.01,44.45 | 80.01,44.45 96.52,44.45 | 96.52,44.45 99.06,44.45 | 111.76,44.45 114.3,44.45 | 114.3,44.45 130.81,44.45 | 130.81,44.45 133.35,44.45 | 113.03,45.72 114.3,44.45 | 132.08,45.72 130.81,44.45 | 97.79,45.72 96.52,44.45 | 78.74,45.72 80.01,44.45 | 63.5,45.72 62.23,44.45 | 44.45,45.72 45.72,44.45 | 78.74,45.72 IC2.10

### Text on the board
Bottom: ESP8266 Network time protocol. CMMC ******